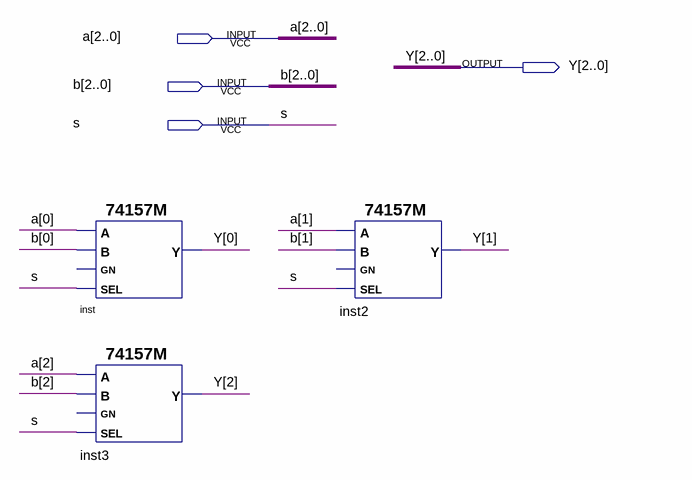
[diagram p0: schematic sheet]
// Quartus schematic mux2to1bit3.bdf as structural Verilog: 3 symbols, 4 pins
module mux2to1bit3 (
  input  [2:0] a,
  input  [2:0] b,
  input  s,
  output [2:0] Y
);

  \74157M  inst (.SEL(s), .B(b[0]), .A(a[0]), .Y(Y[0]));  // open: GN
  \74157M  inst3 (.SEL(s), .B(b[2]), .A(a[2]), .Y(Y[2]));  // open: GN
  \74157M  inst2 (.SEL(s), .B(b[1]), .A(a[1]), .Y(Y[1]));  // open: GN
endmodule
